# EAGLE design H3AR00 (EAGLE 9.6.1)
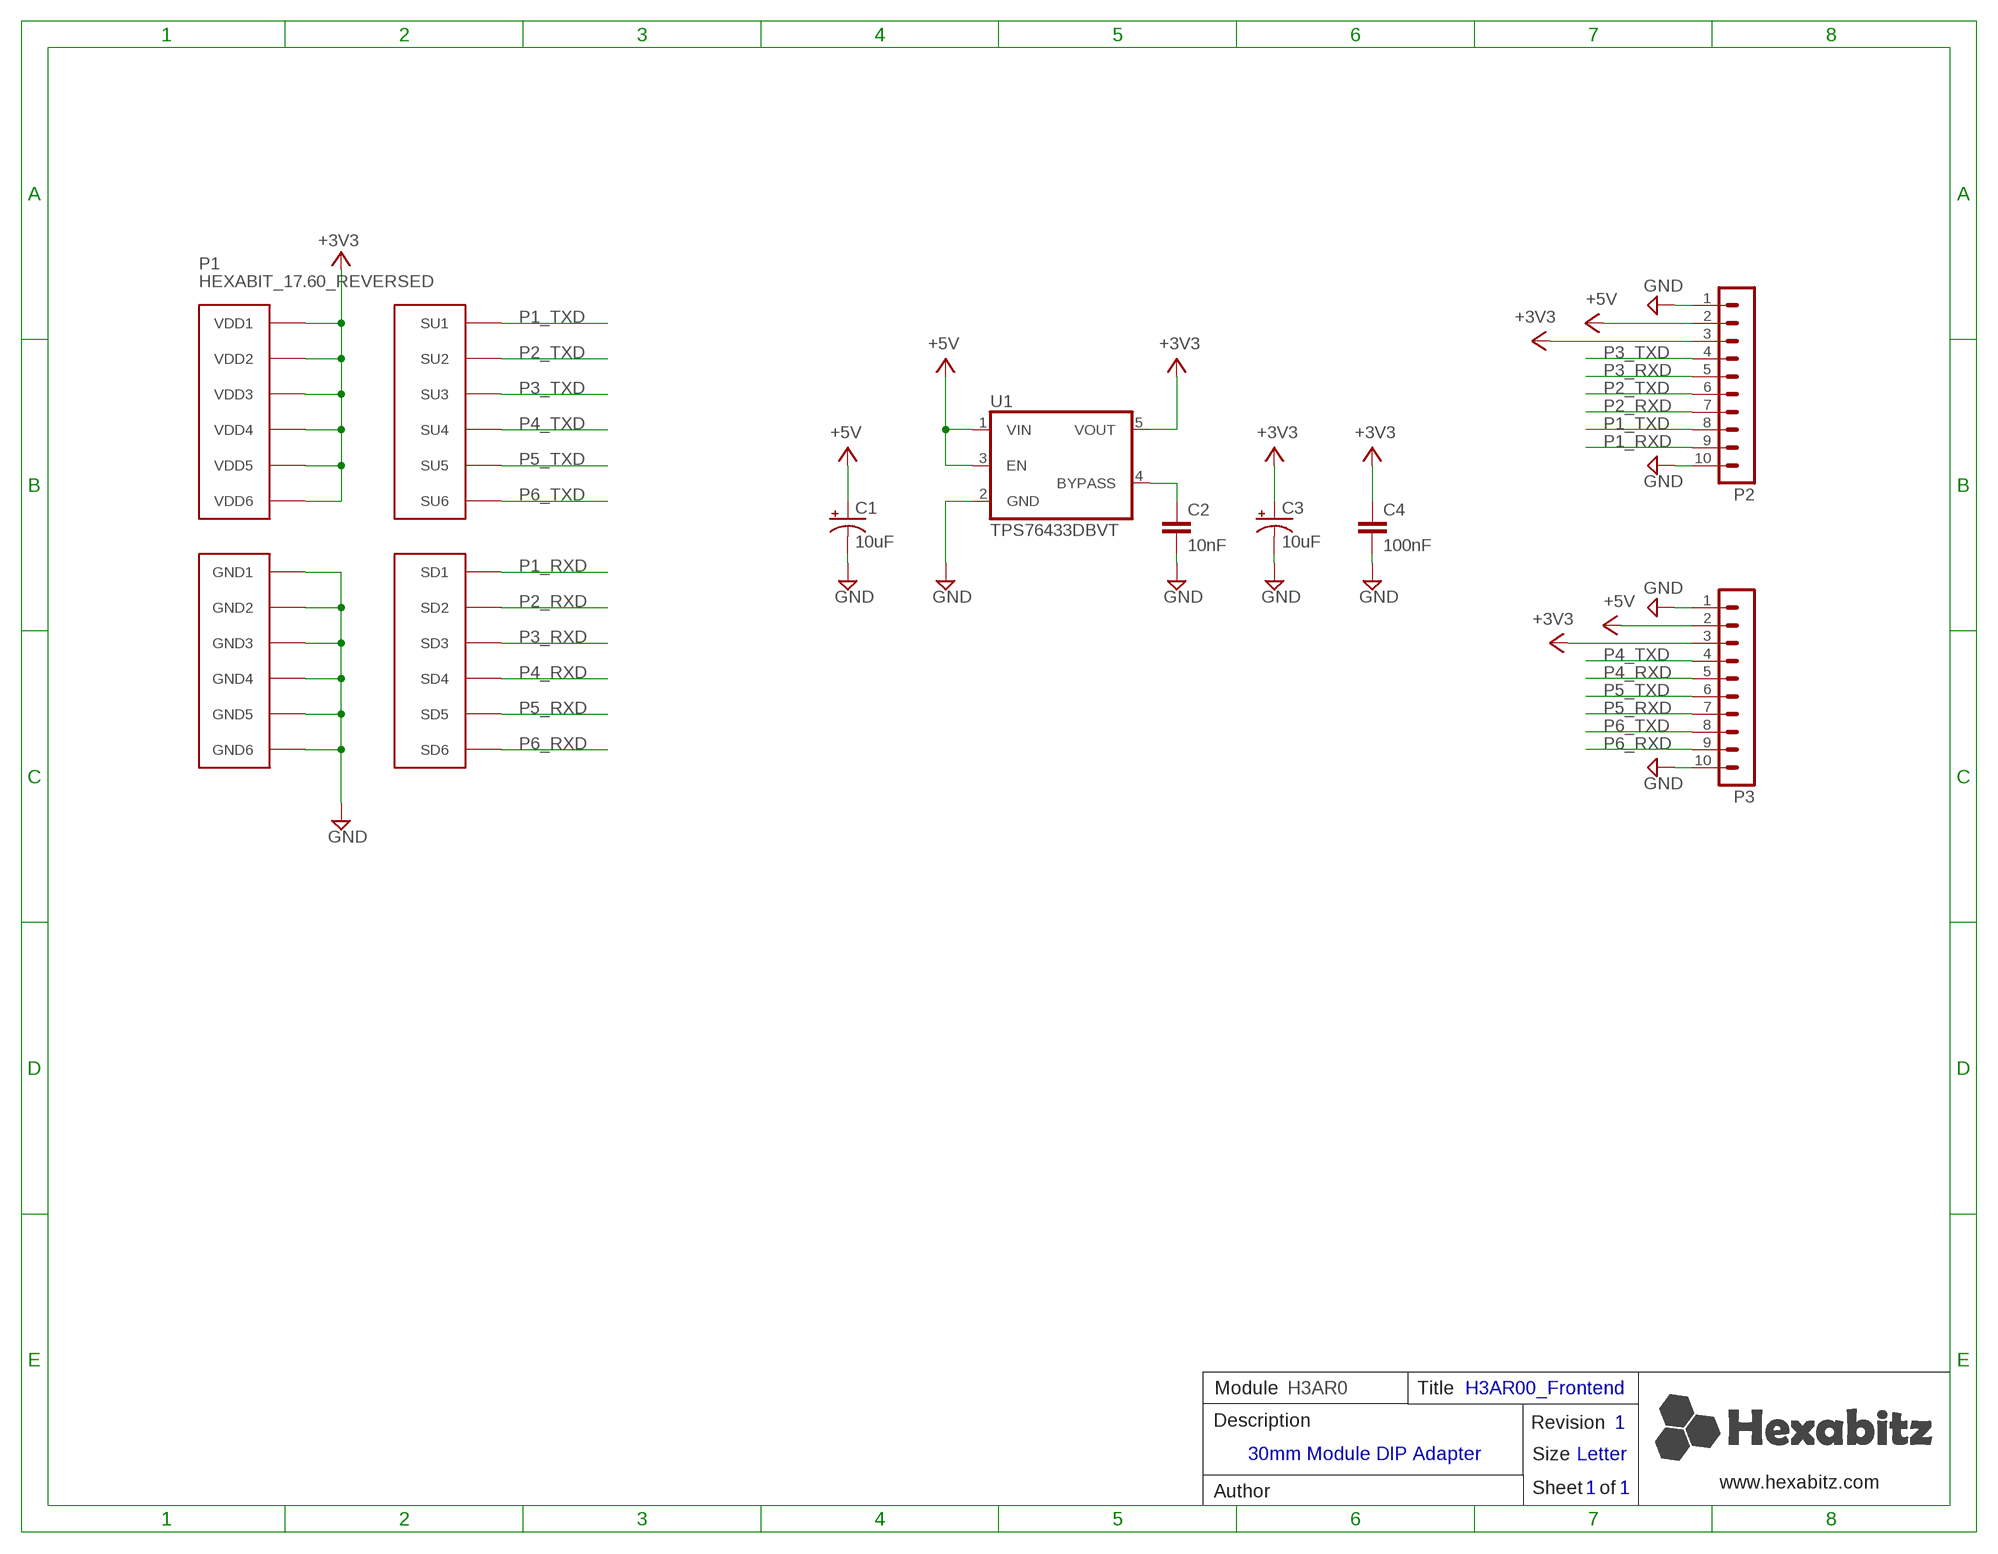
[diagram p0: schematic, sheet 1]

## Parts
C1  10uF  C-1210-POL  [C-1210-POL]
C2  10nF  C-0603  [C-0603]
C3  10uF  C-1210-POL  [C-1210-POL]
C4  100nF  C-0603  [C-0603]
P1  HEXABIT_17.60_REVERSED  [HEXABIT_17.60_REVERSED]
P2  MA10-1  [MA10-1]
P3  MA10-1  [MA10-1]
U1  TPS76433DBVT  [SOT25]

## Nets
+3V3: C3.1(+) C4.1 P1.PAD_PU7(VDD1) P1.PAD_PU8(VDD2) P1.PAD_PU9(VDD3) P1.PAD_PU10(VDD4) P1.PAD_PU11(VDD5) P1.PAD_PU12(VDD6) P2.3 P3.3 U1.5(VOUT)
+5V: C1.1(+) P2.2 P3.2 U1.1(VIN) U1.3(EN)
GND: C1.2(-) C2.2 C3.2(-) C4.2 P1.PAD_PD7(GND1) P1.PAD_PD8(GND2) P1.PAD_PD9(GND3) P1.PAD_PD10(GND4) P1.PAD_PD11(GND5) P1.PAD_PD12(GND6) P2.1 P2.10 P3.1 P3.10 U1.2(GND)
N$1: C2.1 U1.4(BYPASS)
P1_RXD: P1.PAD_PD1(SD1) P2.9
P1_TXD: P1.PAD_PU1(SU1) P2.8
P2_RXD: P1.PAD_PD2(SD2) P2.7
P2_TXD: P1.PAD_PU2(SU2) P2.6
P3_RXD: P1.PAD_PD3(SD3) P2.5
P3_TXD: P1.PAD_PU3(SU3) P2.4
P4_RXD: P1.PAD_PD4(SD4) P3.5
P4_TXD: P1.PAD_PU4(SU4) P3.4
P5_RXD: P1.PAD_PD5(SD5) P3.7
P5_TXD: P1.PAD_PU5(SU5) P3.6
P6_RXD: P1.PAD_PD6(SD6) P3.9
P6_TXD: P1.PAD_PU6(SU6) P3.8

## Notes on the sheet
- Module | H3AR0 | Title | H3AR00_Frontend
- Description | Revision | 1
- 30mm Module DIP Adapter
- Size | Letter
- www.hexabitz.com
- Author | Sheet   of | 1 | 1
- C:/Users/Admin/Desktop/logodraft.bmp

## Library data of the parts
C1 C3 = Hexabitz:C-1210-POL: Cap Tant Solid SMD 1210 Pol; CAPACITANCE: 10uF; MFN: AVX; MPN: TPSB106K016R0500; OCTOPART_URL: https://octopart.com/tpsb106k016r0500-avx-1436890?r=sp#
C2 = Hexabitz:C-0603: CAP CER 10% X7R 0603; CAPACITANCE: 10nF; MFN: KEMET; MPN: C0603C103K5RACTU; OCTOPART_URL: https://octopart.com/c0603c103k5ractu-kemet-133094?r=sp&s=R_iPBxLnSmGqhkU2rIMFpg; TOLERANCE: 10%; VOLTAGE_RATING: 50V
C4 = Hexabitz:C-0603: CAP CER 10% X7R 0603; CAPACITANCE: 100nF; MFN: KEMET; MPN: C0603C104K8RACTU; OCTOPART_URL: https://octopart.com/c0603c104k8ractu-kemet-145075?r=sp&s=9bS9ASSwSEqMCE9KBEQZ0g; TOLERANCE: 10%; VOLTAGE_RATING: 10V
P1 = hexabitz_connectors:HEXABIT_?_REVERSED: Hexabitz Hexagon Module Connector Hexagon side length = 18.00mm. Reversed inside-out.
P2 P3 = Hexabitz:MA10-1: PIN HEADER; MFN: Würth Elektronik; MPN: 61301011121; OCTOPART_URL: https://octopart.com/61301011121-w%C3%BCrth+elektronik-18818159?r=sp; OC_FARNELL: unknown; OC_NEWARK: unknown
U1 = Hexabitz:TPS764: 150mA Low Noise LDO Voltage Regulator with Enable; MFN: Texas Instruments; MPN: TPS76433DBVT; OCTOPART_URL: https://octopart.com/tps76433dbvt-texas+instruments-69873?r=sp&s=0aHKKhMLSUCTmmqJkhwwIQ

## Board
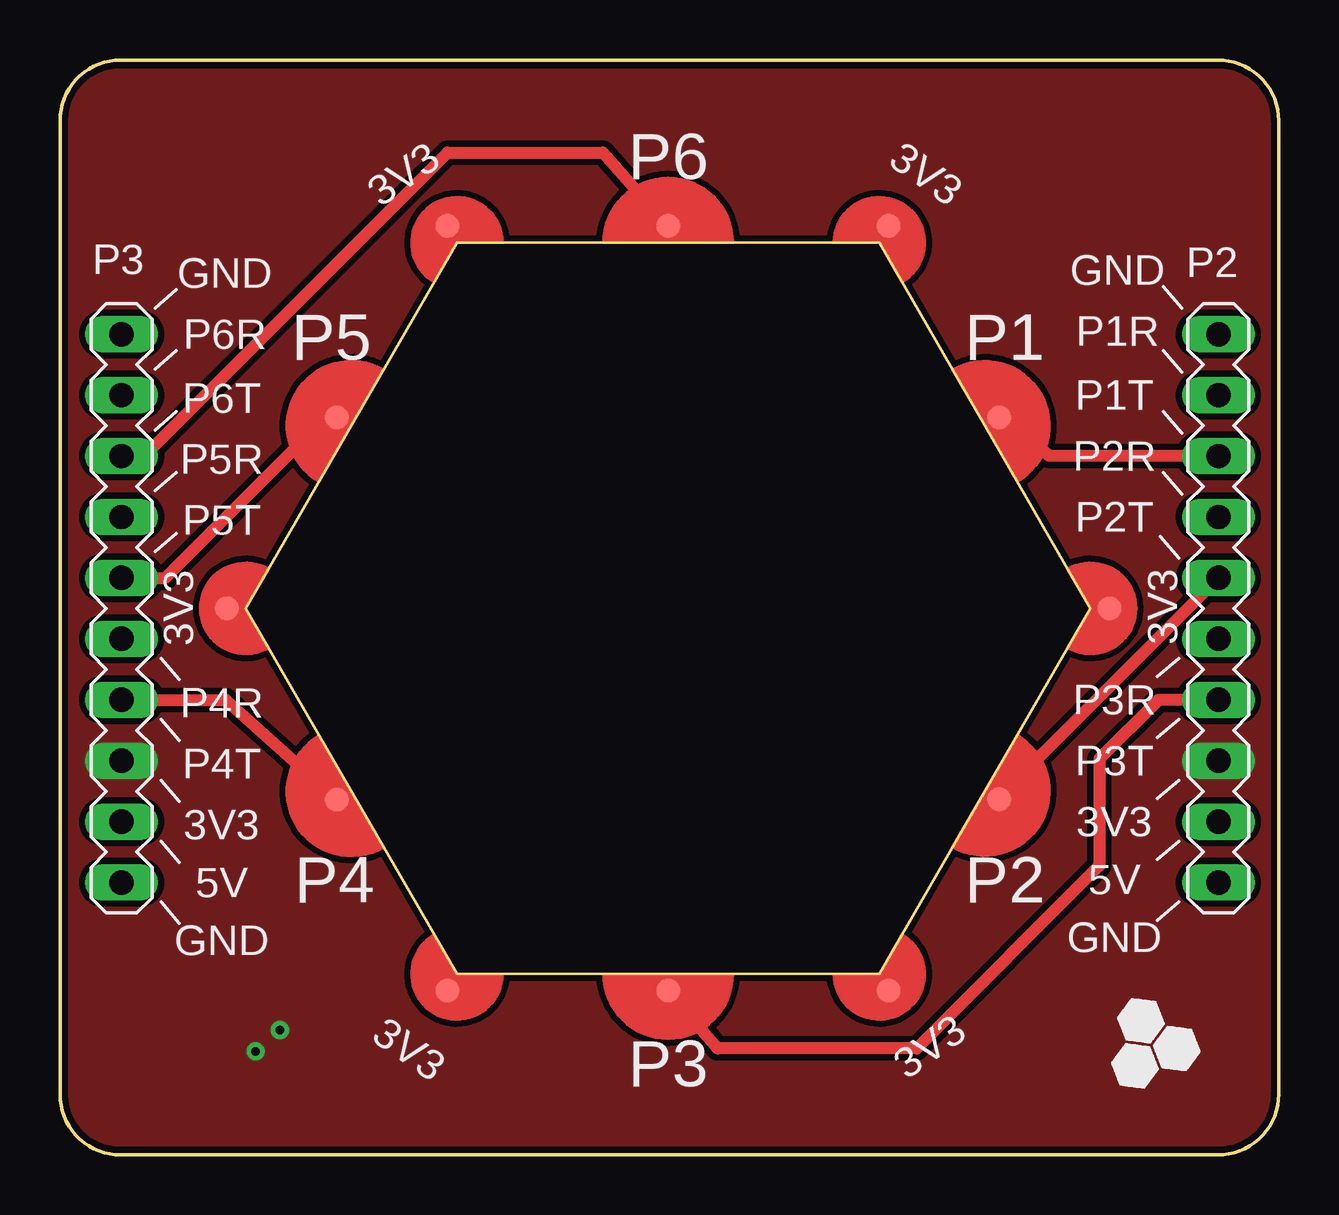
[diagram p1: board, top side]
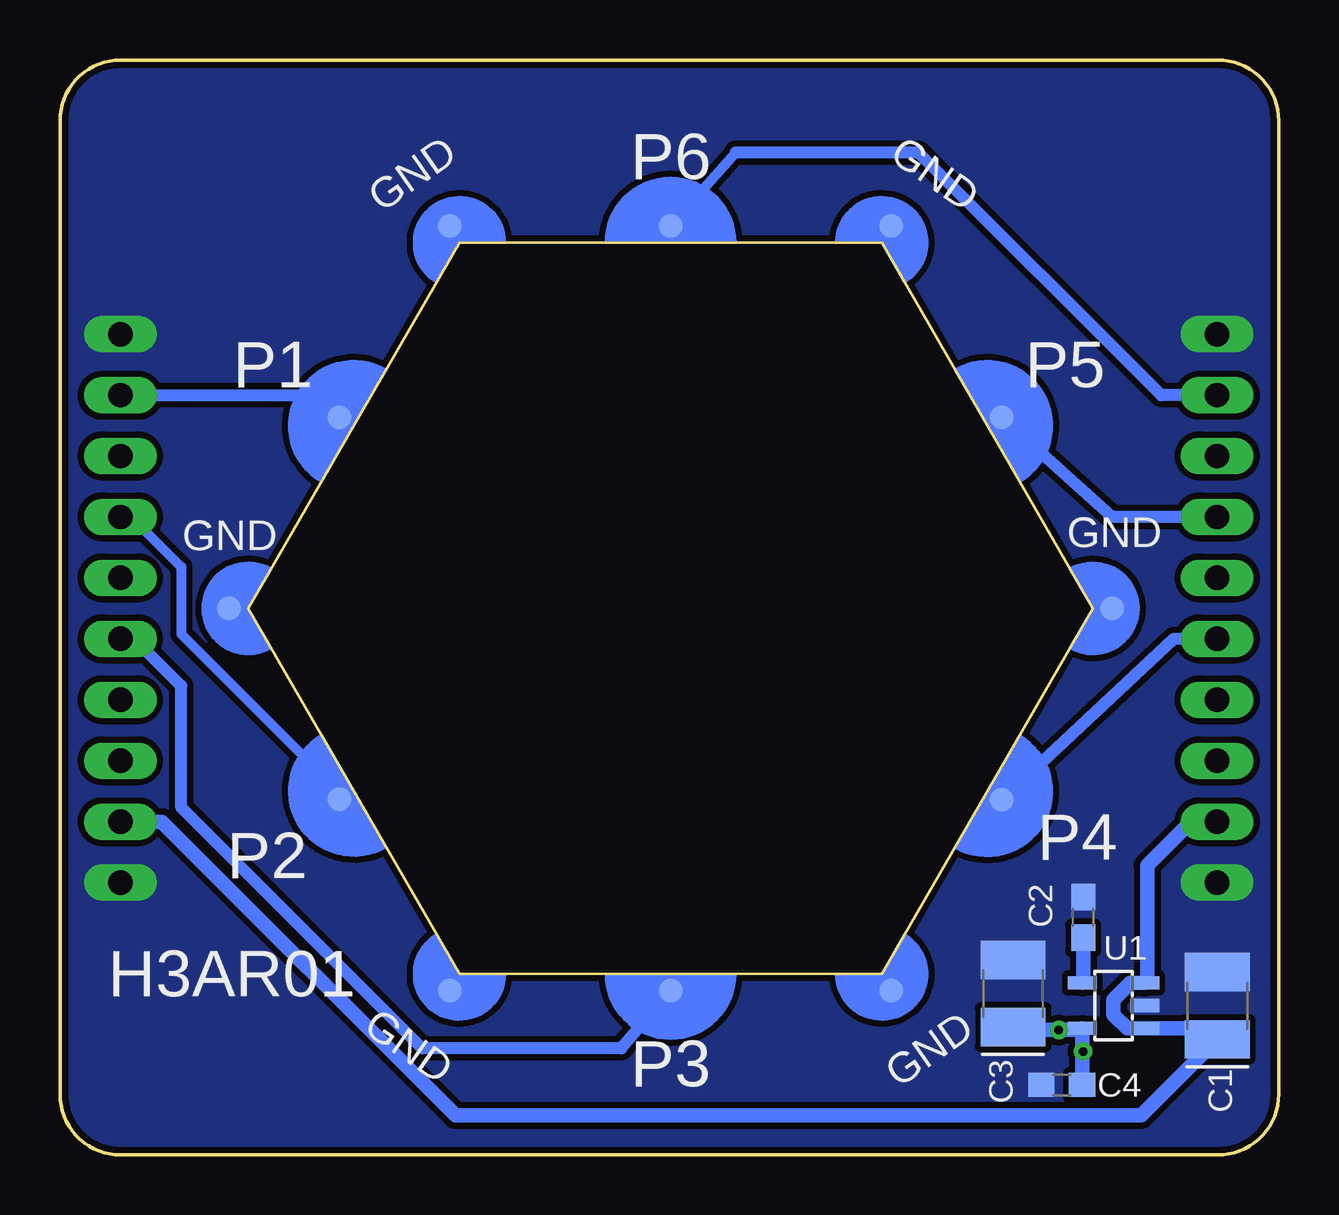
[diagram p2: board, bottom side, seen from below]

Size 50.8 x 45.64 mm. Coordinates in mm from the lower left corner, seen from the top.
Outline: 0,2.54 0,43.1 arc-90 2.54,45.64 48.26,45.64 arc-90 50.8,43.1 50.8,2.54 arc-90 48.26,0 2.54,0 arc-90 0,2.54
Copper layers (1*16): Top 0.035mm / dielectric 1.5mm / Bottom 0.035mm
Design rules "2_layer": minimum track width 7mil, minimum drill 10mil, track to track 6mil, track to pad 6mil, pad to pad 6mil, via to via 6mil, smd to smd 0mil, copper to edge 1mil, drill to drill 8mil, minimum pad ring 10mil, minimum via ring 8mil, stop-mask expansion 2mil, vias tented up to drill 15mil, thermal gap 10mil

### Footprints (pad centres in the part's own frame; a part is rotated, then mirrored left to right if it is on the bottom)
C-1210-POL = smd 1.6 x 2.7: 1 -1.4,0; 2 1.4,0
C-0603 = smd 1.1 x 1: 1 -0.85,0; 2 0.85,0
HEXABIT_17.60_REVERSED = smd 1 x 1 bottom: PAD_PD1 13.8,7.957; PAD_PD2 13.8,-7.957; PAD_PD3 0,-15.934; PAD_PD4 -13.8,-7.977; PAD_PD5 -13.8,7.957; PAD_PD6 0,15.934; PAD_PD7 9.2,15.934; PAD_PD8 18.4,0; PAD_PD9 9.2,-15.934; PAD_PD10 -9.2,-15.934; PAD_PD11 -18.4,0; PAD_PD12 -9.2,15.934 | smd 1 x 1: PAD_PU1 13.8,7.957; PAD_PU2 13.8,-7.957; PAD_PU3 0,-15.934; PAD_PU4 -13.8,-7.977; PAD_PU5 -13.8,7.957; PAD_PU6 0,15.934; PAD_PU7 9.2,15.934; PAD_PU8 18.4,0; PAD_PU9 9.2,-15.934; PAD_PU10 -9.2,-15.934; PAD_PU11 -18.4,0; PAD_PU12 -9.2,15.934
MA10-1 = drill 1.016 long: 1 -11.43,0; 2 -8.89,0; 3 -6.35,0; 4 -3.81,0; 5 -1.27,0; 6 1.27,0; 7 3.81,0; 8 6.35,0; 9 8.89,0; 10 11.43,0
SOT25 = smd 0.55 x 1.2: 1 -0.95,-1.3; 2 0,-1.3; 3 0.95,-1.3; 4 0.95,1.3; 5 -0.95,1.3

### Placement (x,y rotation side)
C1  2.57,6.22 90 bottom
C2  8.15,9.91 90 bottom
C3  11.07,6.73 90 bottom
C4  9.04,2.92 180 bottom
P1  25.35,22.78 0 top
P2  48.29,22.78 90 top
P3  2.57,22.78 90 top
U1  6.88,6.22 90 bottom

### Tracks (layer width: path | path; a pad name or v marks a point on that pad's centre or on a via)
+3V3  (via drill 0.35)
  Bottom 0.61: C4.1 U1.5 8.25,5.21 v9.17,5.21 10.95,5.21 C3.1
  other vias: 8.15,4.32
  pour Top (isolate 0.254, no thermals): 0.03,3.3 0.03,2.5 arc90 2.57,-0.04 48.29,-0.04 arc90 50.83,2.49 50.87,13.21 50.83,40.01 50.83,43.07 arc90 48.29,45.61 18.75,45.61 2.56,45.6 arc90 0.03,43.06 0.03,13.22 0.05,13.22
+5V
  Bottom 0.61: P3.2 3.66,13.89 5.49,12.06 5.49,7.27 U1.3 6.19,7.17 6.88,6.48 6.88,5.84 6.31,5.27 U1.1 3.02,5.27 C1.1 5.73,1.65 34.32,1.65 46.56,13.89 P2.2
GND
  pour Bottom (isolate 0.254, no thermals): 0.03,-0.04 30.17,-0.04 50.83,0 50.83,35.7 50.8,35.7 50.83,44.07 50.83,45.61 20.53,45.61 0.03,45.59 0.03,10.09 0.02,10.09 0.03,2.03
N$1
  Bottom 0.61: C2.1 8.15,7.2 U1.4
P1_RXD
  Bottom 0.508: P2.9 40.21,31.67 P1.PAD_PD1
P1_TXD
  Top 0.508: P2.8 41.23,29.13 P1.PAD_PU1
P2_RXD
  Bottom 0.406: 39.45,15.42 45.75,21.71 45.75,24.51 47.83,26.59
  Bottom 0.508: P2.7 47.83,26.59 | 39.45,15.42 P1.PAD_PD2
P2_TXD
  Top 0.508: P2.6 39.45,15.22 P1.PAD_PU2
P3_RXD
  Bottom 0.508: P1.PAD_PD3 27.41,4.44 35.71,4.44 45.75,14.48 45.75,19.56 47.7,21.51 P2.5
P3_TXD
  Top 0.508: P2.4 45.8,18.97 43.33,16.51 43.33,12.06 35.71,4.44 27.41,4.44 P1.PAD_PU3
P4_RXD
  Bottom 0.508: P3.5 4.37,21.51 P1.PAD_PD4
P4_TXD
  Top 0.508: P3.4 6.91,18.97 P1.PAD_PU4
P5_RXD
  Bottom 0.508: P3.7 6.93,26.59 P1.PAD_PD5
P5_TXD
  Top 0.508: P3.6 4.39,24.05 11.25,30.91 P1.PAD_PU5
P6_RXD
  Bottom 0.406: 22.63,41.78 P1.PAD_PD6
  Bottom 0.508: P3.9 4.9,31.67 15.01,41.78 22.63,41.78
P6_TXD
  Top 0.508: P3.8 3.51,29.13 16.15,41.78 22.63,41.78 P1.PAD_PU6

### Text on the board
tPlace: P6 | 3V3 | 3V3 | GND | GND | P1R | P6R | P5 | P1 | P6T | P1T | P5R | P2R | P5T | P2T | 3V3 | 3V3 | P4R | P3R | P4T | P3T | 3V3 | 3V3 | 5V | P4 | P2 | 5V | GND | GND | 3V3 | 3V3 | P3
bPlace: P6 | GND | GND | P5 | P1 | GND | GND | P4 | P2 | H3AR01 | GND | GND | P3